# Altium project FPGA_SHIELD_MARK1.PrjPcb (part 2 of 2)

## Sheet LOGIC_MCU.SchDoc: Microcontroller Logical Interconnect
size B; Author: Michael Jones; Engineer: Michael Jones; Organization: Group VIII Technology; Address1: 1652 W 820 N; Address2: Provo; Address3: UT  84601; Address4: 801-379-0118; DocumentNumber: 6; Revision: A3; SheetNumber: 6; SheetTotal: 6
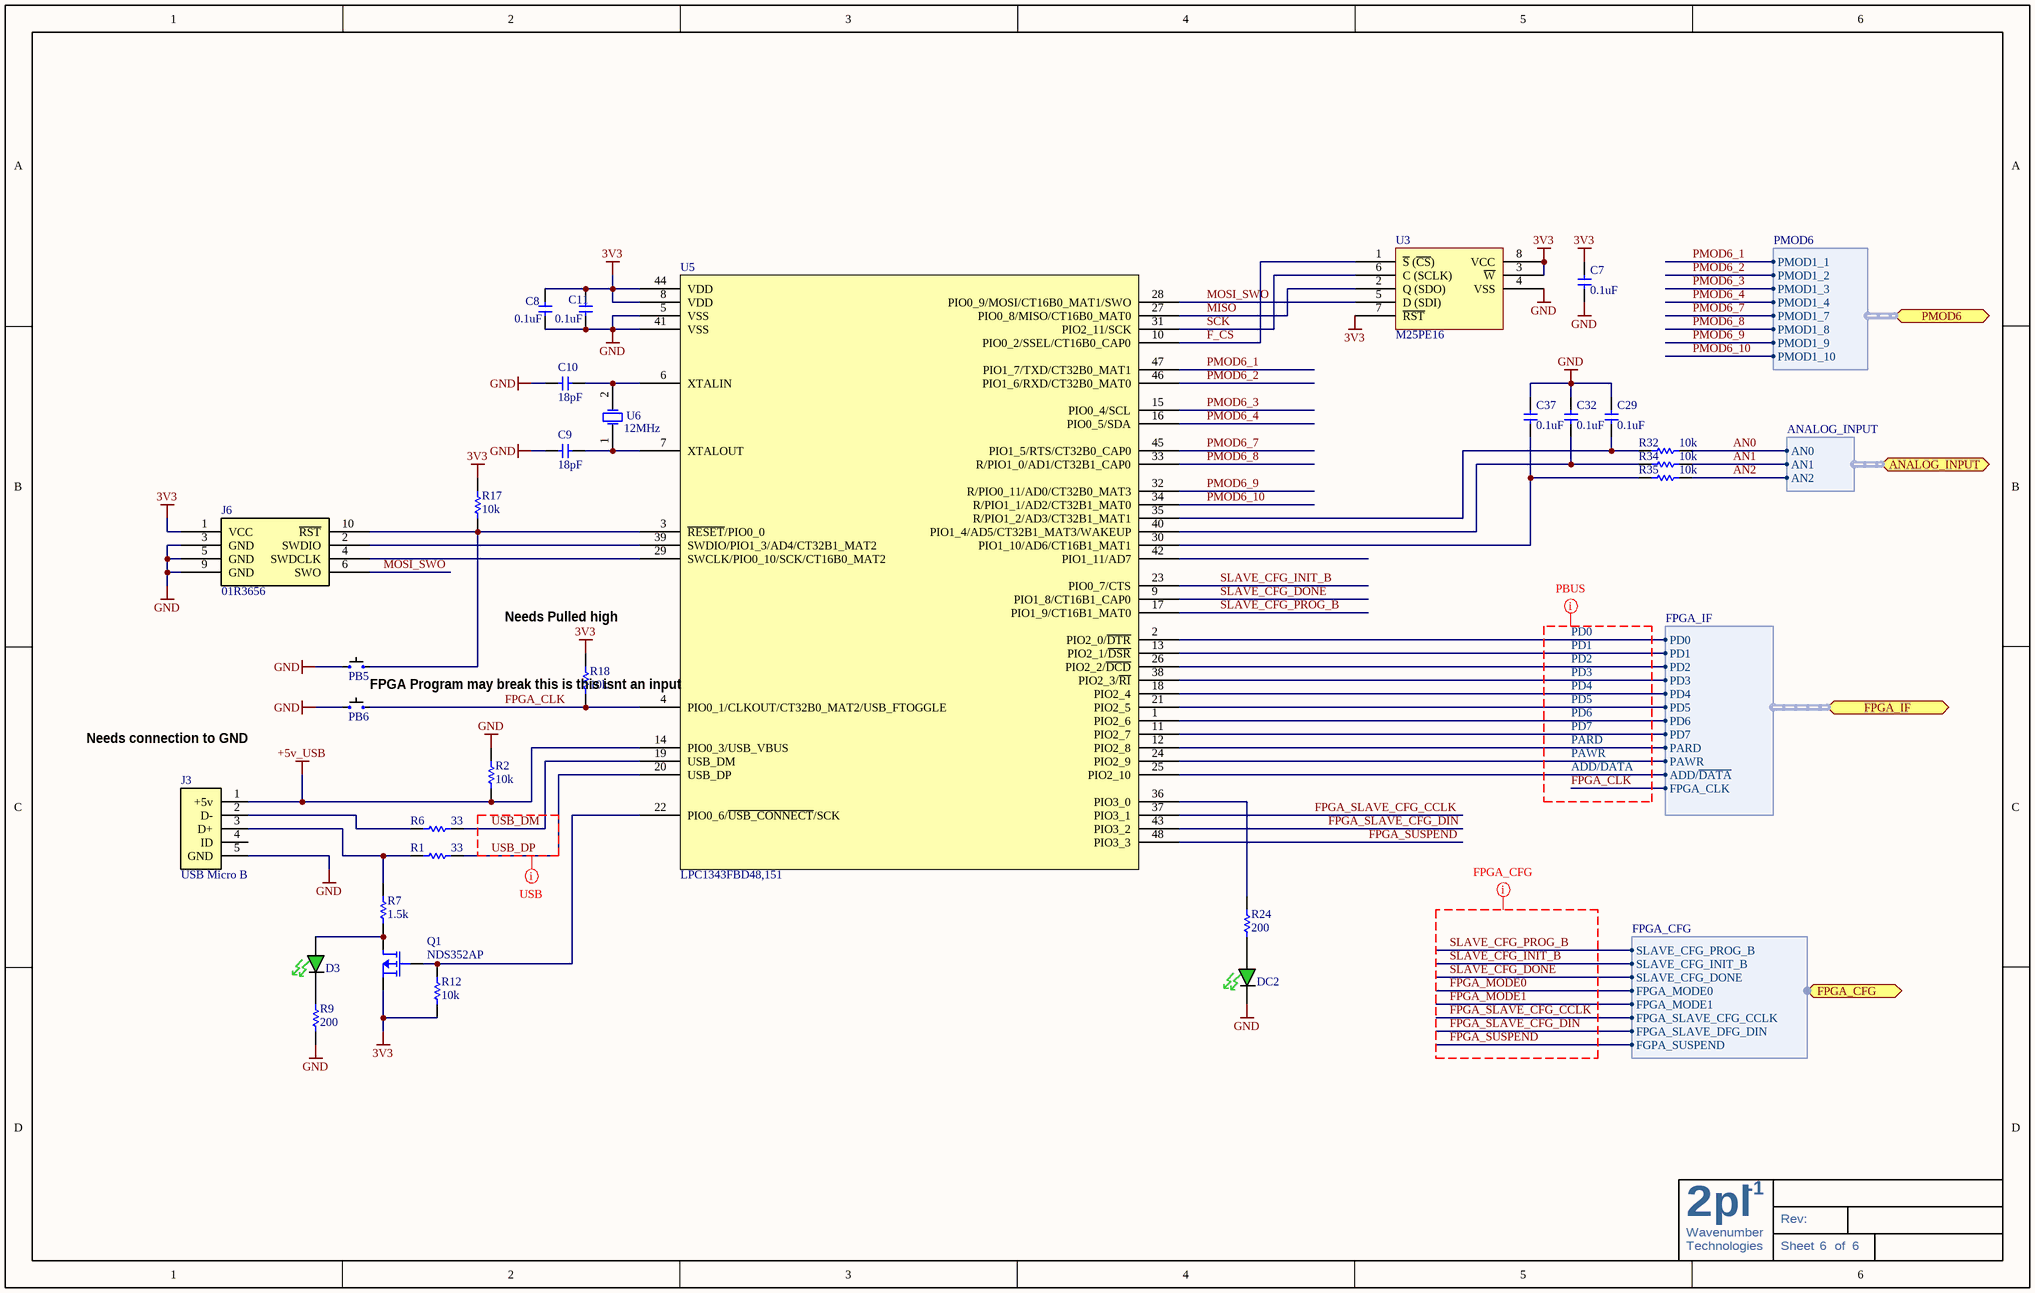
[diagram p4: LOGIC_MCU.SchDoc]

### Parts
(Parts that share a designator on the sheet are numbered #1, #2 ... from top to bottom, then left to right.)
C7#2  0.1uF  [C0603]
C8#2  0.1uF  [C0603]
C9#2  18pF  [C0603]
C10#2  18pF  [C0603]
C11#2  0.1uF  [C0603]
C29#2  0.1uF  [C0603]
C32#2  0.1uF  [C0603]
C37  0.1uF  [C0603]
D3#2  LED 1.6X0.8MM 570NM GRN CLR SMD  [LED_0603 - GREEN]  (value not drawn)
DC2  LED 1.6X0.8MM 570NM GRN CLR SMD  [LED_0603 - GREEN]  (value not drawn)
J3#2  USB Micro B  [10103594-0001LF - Testing Smaller Thru]
J6#2  01R3656  [FTSH-105-04-F-DV]
PB5  FSM4JSMA  [FSM4JSMA]  (value not drawn)
PB6  FSM4JSMA  [FSM4JSMA]  (value not drawn)
Q1  NDS352AP  [SOT-23]
R1#2  33  [R0603]
R2#2  10k  [R0603]
R6#2  33  [R0603]
R7#2  1.5k  [R0603]
R9  200  [R0603]
R12  10k  [R0603]
R17  10k  [R0603]
R18  10k  [R0603]
R24  200  [R0603]
R32  10k  [R0603]
R34  10k  [R0603]
R35  10k  [R0603]
U3#2  M25PE16  [SOIC127P830X200-8L]
U5  LPC1343FBD48,151  [TSQFP50P900X900X145-48L]
U6  12MHz  [ABM3]

### Ports
ANALOG_INPUT (harness ANALOG_INPUT), FPGA_CFG (harness FPGA_CFG), FPGA_IF (harness FPGA_IF), PMOD6 (harness PMOD6)

### Harnesses
FPGA_IF: PD0, PD1, PD2, PD3, PD4, PD5, PD6, PD7, PARD, PAWR, ADD/~{DATA}, FPGA_CLK
FPGA_CFG: SLAVE_CFG_PROG_B, SLAVE_CFG_INIT_B, SLAVE_CFG_DONE, FPGA_MODE0, FPGA_MODE1, FPGA_SLAVE_CFG_CCLK, FPGA_SLAVE_DFG_DIN, FGPA_SUSPEND
PMOD6: PMOD1_1, PMOD1_2, PMOD1_3, PMOD1_4, PMOD1_7, PMOD1_8, PMOD1_9, PMOD1_10
ANALOG_INPUT: AN0, AN1, AN2

### Nets
3V3: C7#2.2 C8#2.2 C11#2.2 J6#2.1(VCC) Q1.2(S) R12.2 R17.1 R18.1 U3#2.3(~{W}) U3#2.7(~{RST}) U3#2.8(VCC) U5.8(VDD) U5.44(VDD)
+5v_USB: J3#2.1(+5v) R2#2.2 U5.14(PIO0_3/USB_VBUS)
GND: C7#2.1 C8#2.1 C9#2.1 C10#2.1 C11#2.1 C29#2.2 C32#2.2 C37.2 DC2.C J3#2.5(GND) J6#2.3(GND) J6#2.5(GND) J6#2.9(GND) PB5.A PB6.A R2#2.1 R9.1 U3#2.4(VSS) U5.5(VSS) U5.41(VSS)
ADD/~{DATA}: U5.25(PIO2_10) ; port FPGA_IF.ADD/~{DATA}
AN0: R32.2 ; port ANALOG_INPUT.AN0
AN1: R34.2 ; port ANALOG_INPUT.AN1
AN2: R35.2 ; port ANALOG_INPUT.AN2
F_CS: U3#2.1(~{S}_(~{CS})) U5.10(PIO0_2/SSEL/CT16B0_CAP0)
FPGA_CLK: PB6.B R18.2 U5.4(PIO0_1/CLKOUT/CT32B0_MAT2/USB_FTOGGLE) ; port FPGA_IF.FPGA_CLK
FPGA_SLAVE_CFG_CCLK: U5.37(PIO3_1) ; port FPGA_CFG.FPGA_SLAVE_CFG_CCLK
FPGA_SLAVE_CFG_DIN: U5.43(PIO3_2) ; port FPGA_CFG.FPGA_SLAVE_DFG_DIN
FPGA_SUSPEND: U5.48(PIO3_3) ; port FPGA_CFG.FGPA_SUSPEND
MISO: U3#2.2(Q_(SDO)) U5.27(PIO0_8/MISO/CT16B0_MAT0)
MOSI_SWO: J6#2.6(SWO) U3#2.5(D_(SDI)) U5.28(PIO0_9/MOSI/CT16B0_MAT1/SWO)
PARD: U5.12(PIO2_8) ; port FPGA_IF.PARD
PAWR: U5.24(PIO2_9) ; port FPGA_IF.PAWR
PD0: U5.2(PIO2_0/~{DTR}) ; port FPGA_IF.PD0
PD1: U5.13(PIO2_1/~{DSR}) ; port FPGA_IF.PD1
PD2: U5.26(PIO2_2/~{DCD}) ; port FPGA_IF.PD2
PD3: U5.38(PIO2_3/~{RI}) ; port FPGA_IF.PD3
PD4: U5.18(PIO2_4) ; port FPGA_IF.PD4
PD5: U5.21(PIO2_5) ; port FPGA_IF.PD5
PD6: U5.1(PIO2_6) ; port FPGA_IF.PD6
PD7: U5.11(PIO2_7) ; port FPGA_IF.PD7
PMOD6_1: U5.47(PIO1_7/TXD/CT32B0_MAT1) ; port PMOD6.PMOD1_1
PMOD6_2: U5.46(PIO1_6/RXD/CT32B0_MAT0) ; port PMOD6.PMOD1_2
PMOD6_3: U5.15(PIO0_4/SCL) ; port PMOD6.PMOD1_3
PMOD6_4: U5.16(PIO0_5/SDA) ; port PMOD6.PMOD1_4
PMOD6_7: U5.45(PIO1_5/RTS/CT32B0_CAP0) ; port PMOD6.PMOD1_7
PMOD6_8: U5.33(R/PIO1_0/AD1/CT32B1_CAP0) ; port PMOD6.PMOD1_8
PMOD6_9: U5.32(R/PIO0_11/AD0/CT32B0_MAT3) ; port PMOD6.PMOD1_9
PMOD6_10: U5.34(R/PIO1_1/AD2/CT32B1_MAT0) ; port PMOD6.PMOD1_10
SCK: U3#2.6(C_(SCLK)) U5.31(PIO2_11/SCK)
SLAVE_CFG_DONE: U5.9(PIO1_8/CT16B1_CAP0) ; port FPGA_CFG.SLAVE_CFG_DONE
SLAVE_CFG_INIT_B: U5.23(PIO0_7/CTS) ; port FPGA_CFG.SLAVE_CFG_INIT_B
SLAVE_CFG_PROG_B: U5.17(PIO1_9/CT16B1_MAT0) ; port FPGA_CFG.SLAVE_CFG_PROG_B
USB_DM: R6#2.2 U5.19(USB_DM)
USB_DP: R1#2.2 U5.20(USB_DP)
NetC9#2_2: C9#2.2 U5.7(XTALOUT) U6.1(OSC1)
NetC10#2_2: C10#2.2 U5.6(XTALIN) U6.2(OSC2)
NetC29#2_1: C29#2.1 R32.1 U5.35(R/PIO1_2/AD3/CT32B1_MAT1)
NetC32#2_1: C32#2.1 R34.1 U5.40(PIO1_4/AD5/CT32B1_MAT3/WAKEUP)
NetC37_1: C37.1 R35.1 U5.30(PIO1_10/AD6/CT16B1_MAT1)
NetD3#2_A: D3#2.A Q1.3(D) R7#2.1
NetD3#2_C: D3#2.C R9.2
NetDC2_A: DC2.A R24.2
NetJ3#2_2: J3#2.2(D-) R6#2.1
NetJ3#2_3: J3#2.3(D+) R1#2.1 R7#2.2
NetJ6#2_2: J6#2.2(SWDIO) U5.39(SWDIO/PIO1_3/AD4/CT32B1_MAT2)
NetJ6#2_4: J6#2.4(SWDCLK) U5.29(SWCLK/PIO0_10/SCK/CT16B0_MAT2)
NetJ6#2_10: J6#2.10(~{RST}) PB5.B R17.2 U5.3(~{RESET}/PIO0_0)
NetQ1_1: Q1.1(G) R12.1 U5.22(PIO0_6/~{USB_CON}~{NECT}/SCK)
NetR24_1: R24.1 U5.36(PIO3_0)

Not connected (* = marked no-connect by the designer): J3#2 4(ID); U5 42(PIO1_11/AD7)

### Layout directives
net class PBUS: ADD/~{DATA}, FPGA_CLK, PARD, PAWR, PD0, PD1, PD2, PD3, PD4, PD5, PD6, PD7
net class FPGA_CFG: FPGA_MODE0, FPGA_MODE1, FPGA_SLAVE_CFG_CCLK, FPGA_SLAVE_CFG_DIN, FPGA_SUSPEND, SLAVE_CFG_DONE, SLAVE_CFG_INIT_B, SLAVE_CFG_PROG_B
net class USB: USB_DP

### Notes on the sheet
- Needs Pulled high
- FPGA Program may break this is this isnt an input
- Needs connection to GND
- 2
- Wavenumber
- pl
- -1
- Rev:
- Technologies
- Sheet
- of

### Library data of the parts
C7#2 C8#2 C11#2 C29#2 C32#2 C37 = GRM188R71H104KA93D: CAP CER .1UF 50V 10% X7R 0603; Manufacturer: Murata Electronics North America; Capacitance: 0.1µF; Value: 0.1uF; Supplier 1: Digi-Key; Supplier Part Number 1: 490-1519-1-ND; Manufacturer Part Number: GRM188R71H104KA93D; RoHS: RoHS Compliant; Category: Capacitors; Stock 1: 6315460; Pricing 1: 10=0.037, 100=0.0221, 500=0.01276, 1000=0.00884 (USD); Voltage - Rated: 50V; Tolerance: ±10%; Temperature Coefficient: X7R; Mounting Type: Surface Mount, MLCC; Operating Temperature: -55°C ~ 125°C; Features: -; Applications: General Purpose; Ratings: -; Package / Case: 0603 (1608 Metric); Size / Dimension: 0.063" L x 0.031" W (1.60mm x 0.80mm); Lead Spacing: -; Thickness: 0.80mm; Packaging: Cut Tape (CT); Lead Style: -; ComponentLink1URL: http://search.murata.co.jp/Ceramy/image/img/PDF/ENG/GRM188R71H104KA93.pdf; ComponentLink1Description: http://search.murata.co.jp/Ceramy/image/img/PDF/ENG/GRM188R71H104KA93.pdf
C9#2 C10#2 = GRM1885C1H180JA01D: CAP CER 18PF 50V 5% C0G 0603; Source Part Number: 490-1409-1-ND; Manufacturer: Murata Electronics North America; Temperature Coefficient: C0G, NP0; Source: Digikey; Manufacturer Part Number: GRM1885C1H180JA01D; ROHS Certificate: *; Value: CAP CER 18PF 50V 5% C0G 0603; Supplier 1: Digi-Key; Supplier Part Number 1: 490-1409-1-ND; RoHS: RoHS Compliant; Category: Capacitors; Stock 1: 357140; Pricing 1: 10=0.037, 100=0.0221, 500=0.01276, 1000=0.00884 (USD); Capacitance: 18pF; Voltage - Rated: 50V; Tolerance: ±5%; Mounting Type: Surface Mount, MLCC; Operating Temperature: -55°C ~ 125°C; Features: -; Applications: General Purpose; Ratings: -; Package / Case: 0603 (1608 Metric); Size / Dimension: 0.063" L x 0.031" W (1.60mm x 0.80mm); Lead Spacing: -; Thickness: 0.80mm; Packaging: Cut Tape (CT); Lead Style: -; ComponentLink1URL: http://search.murata.co.jp/Ceramy/image/img/PDF/ENG/GRM1885C1H180JA01.pdf; ComponentLink1Description: http://search.murata.co.jp/Ceramy/image/img/PDF/ENG/GRM1885C1H180JA01.pdf
D3#2 = APT1608CGCK: Manufacturer: Kingbright Corp; Color: Green; Current - Test: 20mA; Wavelength - Peak: 574nm; Millicandela Rating: 50mcd; Voltage - Forward (Vf) Typ: 2.1V; Lens Type: Clear; Lens Style/Size: Rectangle, 1.2mm x 0.8mm; Viewing Angle: 120°; Value: LED 1.6X0.8MM 570NM GRN CLR SMD; Supplier 1: Digi-Key; Supplier Part Number 1: 754-1116-2-ND; Manufacturer Part Number: APT1608CGCK; RoHS: RoHS Compliant; Description: LED 1.6X0.8MM 570NM GRN CLR SMD; Category: Optoelectronics; Stock 1: 94000; Pricing 1: 2000=0.051, 6000=0.045, 10000=0.043 (USD); Luminous Flux @ Current - Test: -; Wavelength - Dominant: 570nm; Size / Dimension: 1.60mm L x 0.80mm W; Height: 0.75mm; Package / Case: 0603 (1608 Metric); Mounting Type: Surface Mount; Packaging: Tape & Reel (TR); ComponentLink1URL: http://www.us.kingbright.com/images/catalog/SPEC/APT1608CGCK.pdf; ComponentLink1Description: http://www.us.kingbright.com/images/catalog/SPEC/APT1608CGCK.pdf
DC2 = APT1608CGCK: Manufacturer: Kingbright Corp; Current - Test: 20mA; Wavelength - Peak: 574nm; Millicandela Rating: 50mcd; Voltage - Forward (Vf) Typ: 2.1V; Lens Type: Clear; Lens Style/Size: Rectangle, 1.2mm x 0.8mm; Viewing Angle: 120°; Value: LED 1.6X0.8MM 570NM GRN CLR SMD; Supplier 1: Digi-Key; Supplier Part Number 1: 754-1116-2-ND; Manufacturer Part Number: APT1608CGCK; RoHS: RoHS Compliant; Description: LED 1.6X0.8MM 570NM GRN CLR SMD; Category: Optoelectronics; Stock 1: 94000; Pricing 1: 2000=0.051, 6000=0.045, 10000=0.043 (USD); Color: Green; Luminous Flux @ Current - Test: -; Wavelength - Dominant: 570nm; Size / Dimension: 1.60mm L x 0.80mm W; Height: 0.75mm; Package / Case: 0603 (1608 Metric); Mounting Type: Surface Mount; Packaging: Tape & Reel (TR); ComponentLink1URL: http://www.us.kingbright.com/images/catalog/SPEC/APT1608CGCK.pdf; ComponentLink1Description: http://www.us.kingbright.com/images/catalog/SPEC/APT1608CGCK.pdf
J3#2 = 10103594-0001LF - USB Micro: CONN RCPT STD MICRO USB TYPE B; Manufacturer: FCI; Connector Type: USB - micro B; Number of Contacts: 5; Gender: Receptacle; Specifications: USB 2.0; Micro USB B: Value; Notes: Similar to; Supplier 1: Digi-Key; Manufacturer Part Number: 10103594-0001LF; RoHS: RoHS Compliant; Category: Connectors, Interconnects; Stock 1: 23288; Pricing 1: 1=1.1, 10=0.768, 100=0.517, 250=0.43912, 500=0.41716 (USD); Mounting Type: Surface Mount, Right Angle, Horizontal; Features: Shielded, Solder Retention; Packaging: Cut Tape (CT); Ingress Protection: -; ComponentLink1URL: http://portal.fciconnect.com/res/en/pdffiles/doc_search/10103594.pdf; ComponentLink1Description: http://portal.fciconnect.com/res/en/pdffiles/doc_search/10103594.pdf; Supplier Part Number 1: 609-4050-1-ND; Value: USB Micro B
J6#2 = Cortex SWD  Connector: Cortex SWD Connector; Manufacturer: SAMTEC; Description: SAMTEC - FTSH-105-04-F-DV - .050 X .050; Supplier 1: Newark; Supplier Part Number 1: 01R3656; Manufacturer Part Number: FTSH-105-04-F-DV; Category: Connectors; Stock 1: 0; Pricing 1: 1=0.871, 25000=0.754, 50000=0.705 (USD); Value: 01R3656
PB5 PB6 = FSM4JSMATR: SWITCH TACTILE SPST-NO 0.05A 12V; Manufacturer: TE Connectivity; Switch Function: Off-Mom; Contact Rating @ Voltage: 0.05A @ 12VDC; Actuator Type: Standard; Outline: 6.00mm x 6.00mm; Illumination: Non-Illuminated; Operating Force: 160gf; Supplier 1: Digi-Key; Supplier Part Number 1: 450-1759-2-ND; Manufacturer Part Number: FSM4JSMATR; RoHS: RoHS Compliant; Category: Switches; Stock 1: 40800; Pricing 1: 1200=0.154, 2400=0.141, 6000=0.132, 8400=0.123, 12000=0.119, 30000=0.117, 60000=0.115 (USD); Circuit: SPST-NO; Mounting Type: Surface Mount; Termination Style: Gull Wing; Orientation: Vertical; Packaging: Tape & Reel (TR); ComponentLink1URL: http://documents.tycoelectronics.com/commerce/DocumentDelivery/DDEController?Action=srchrtrv&DocNm=2-1437565-7&DocType=CD&DocLang=EN; ComponentLink1Description: http://documents.tycoelectronics.com/commerce/DocumentDelivery/DDEController?Action=srchrtrv&DocNm=2-1437565-7&DocType=CD&DocLang=EN; Value: FSM4JSMA
Q1 = NDS352AP: MOSFET P-CH 30V 900MA SSOT3; Manufacturer: Fairchild Semiconductor; FET Type: MOSFET P-Channel, Metal Oxide; FET Feature: Logic Level Gate; Rds On (Max) @ Id, Vgs: 300 mOhm @ 1A, 10V; Vgs(th) (Max) @ Id: 2.5V @ 250µA; Gate Charge (Qg) @ Vgs: 3nC @ 4.5V; Input Capacitance (Ciss) @ Vds: 135pF @ 15V; Power - Max: 460mW; Value: NDS352AP; Supplier 1: Digi-Key; Supplier Part Number 1: NDS352APCT-ND; Manufacturer Part Number: NDS352AP; RoHS: RoHS Compliant; Category: Discrete Semiconductor Products; Stock 1: 165125; Pricing 1: 1=0.61, 10=0.485, 100=0.364, 250=0.31436, 500=0.27024, 750=0.23163, 1000=0.20957, 2000=0.19303 (USD); Drain to Source Voltage (Vdss): 30V; Current - Continuous Drain (Id) @ 25° C: 900mA; Mounting Type: Surface Mount; Package / Case: TO-236-3, SC-59, SOT-23-3; Packaging: Cut Tape (CT); Supplier Device Package: 3-SSOT; ComponentLink1URL: http://media.digikey.com/pdf/Data%20Sheets/Fairchild%20PDFs/NDS352AP.pdf; ComponentLink1Description: http://media.digikey.com/pdf/Data%20Sheets/Fairchild%20PDFs/NDS352AP.pdf
R1#2 R6#2 = ERJ-3EKF33R0V: RES 33.0 OHM 1/10W 1% 0603 SMD; Manufacturer: Panasonic - ECG; Resistance (Ohms): 33.0; Power (Watts): 0.1W, 1/10W; Temperature Coefficient: ±100ppm/°C; Value: 33; Supplier 1: Digi-Key; Supplier Part Number 1: P33.0HCT-ND; Manufacturer Part Number: ERJ-3EKF33R0V; RoHS: RoHS Compliant; Category: Resistors; Stock 1: 247775; Pricing 1: 1=0.04, 50=0.015, 100=0.0114, 250=0.00844, 500=0.00624, 1000=0.00416 (USD); Composition: Thick Film; Features: -; Tolerance: ±1%; Size / Dimension: 0.063" L x 0.031" W (1.60mm x 0.80mm); Height: 0.018" (0.45mm); Lead Style: Surface Mount (SMD - SMT); Packaging: Cut Tape (CT); Package / Case: 0603 (1608 Metric); ComponentLink1URL: http://industrial.panasonic.com/www-cgi/jvcr13pz.cgi?E+PZ+3+AOA0002+ERJ3EKF33R0V+7+WW; ComponentLink1Description: http://industrial.panasonic.com/www-cgi/jvcr13pz.cgi?E+PZ+3+AOA0002+ERJ3EKF33R0V+7+WW
R2#2 R12 R17 R18 R32 R34 R35 = ERJ-3EKF1002V: RES 10.0K OHM 1/10W 1% 0603 SMD; Source Part Number: P10.0KHCT-ND; Manufacturer: Panasonic - ECG; Power (Watts): 0.1W, 1/10W; Temperature Coefficient: ±100ppm/°C; Source: Digikey; ROHS Certificate: *; RoHS: RoHS Compliant; Category: Resistors; Resistance In Ohms: 10.0K; Composition: Thick Film; Features: -; Tolerance: ±1%; Case: 0603 (1608 metric); Size / Dimension: 0.063" L x 0.031" W (1.60mm x 0.80mm); Height: 0.018" (0.45mm); Lead Style: Surface Mount (SMD - SMT); Packaging: Cut Tape (CT); ComponentLink1URL: http://industrial.panasonic.com/www-cgi/jvcr13pz.cgi?E+PZ+3+AOA0002+ERJ3EKF1002V+7+WW; ComponentLink1Description: http://industrial.panasonic.com/www-cgi/jvcr13pz.cgi?E+PZ+3+AOA0002+ERJ3EKF1002V+7+WW; Manufacturer Part Number: ERJ-3EKF1002V; Supplier 1: Digi-Key; Stock 1: 10570746; Pricing 1: 1=0.04, 50=0.015, 100=0.0114, 250=0.00844, 500=0.00624, 1000=0.00416 (USD); Supplier Part Number 1: P10.0KHCT-ND; Value: 10k
R7#2 = ERJ-3EKF1501V: RES 1.50K OHM 1/10W 1% 0603 SMD; Manufacturer: Panasonic - ECG; Power (Watts): 0.1W, 1/10W; Temperature Coefficient: ±100ppm/°C; Value: 1.5k; Supplier 1: Digi-Key; Supplier Part Number 1: P1.50KHCT-ND; Manufacturer Part Number: ERJ-3EKF1501V; RoHS: RoHS Compliant; Category: Resistors; Stock 1: 1714688; Pricing 1: 1=0.04, 50=0.015, 100=0.0114, 250=0.00844, 500=0.00624, 1000=0.00416 (USD); Resistance (Ohms): 1.50K; Composition: Thick Film; Features: -; Tolerance: ±1%; Size / Dimension: 0.063" L x 0.031" W (1.60mm x 0.80mm); Height: 0.018" (0.45mm); Lead Style: Surface Mount (SMD - SMT); Packaging: Cut Tape (CT); Package / Case: 0603 (1608 Metric); ComponentLink1URL: http://industrial.panasonic.com/www-cgi/jvcr13pz.cgi?E+PZ+3+AOA0002+ERJ3EKF1501V+7+WW; ComponentLink1Description: http://industrial.panasonic.com/www-cgi/jvcr13pz.cgi?E+PZ+3+AOA0002+ERJ3EKF1501V+7+WW
R9 R24 = ERJ-3EKF2000V: RES 200 OHM 1/10W 1% 0603 SMD; Manufacturer: Panasonic - ECG; Power (Watts): 0.1W, 1/10W; Temperature Coefficient: ±100ppm/°C; Manufacturer Part Number: ERJ-3EKF2000V; Value: RES 200 OHM 1/10W 1% 0603 SMD; Supplier 1: Digi-Key; Supplier Part Number 1: P200HCT-ND; RoHS: RoHS Compliant; Category: Resistors; Stock 1: 1279595; Pricing 1: 1=0.04, 50=0.015, 100=0.0114, 250=0.00844, 500=0.00624, 1000=0.00416 (USD); Resistance (Ohms): 200; Composition: Thick Film; Features: -; Tolerance: ±1%; Size / Dimension: 0.063" L x 0.031" W (1.60mm x 0.80mm); Height: 0.018" (0.45mm); Lead Style: Surface Mount (SMD - SMT); Packaging: Cut Tape (CT); Package / Case: 0603 (1608 Metric); ComponentLink1URL: http://industrial.panasonic.com/www-cgi/jvcr13pz.cgi?E+PZ+3+AOA0002+ERJ3EKF2000V+7+WW; ComponentLink1Description: http://industrial.panasonic.com/www-cgi/jvcr13pz.cgi?E+PZ+3+AOA0002+ERJ3EKF2000V+7+WW
U3#2 = M25PE16-VMW6TG: IC FLASH 16MBIT 75MHZ 8SOIC; Manufacturer: Numonyx/ST Micro; Memory Size: 16M (2M x 8); Interface: SPI, 3-Wire Serial; Voltage - Supply: 2.7 V ~ 3.6 V; Supplier 1: Digi-Key; Manufacturer Part Number: M25PE16-VMW6TG; RoHS: RoHS Compliant; Category: Integrated Circuits (ICs); Stock 1: 866; Pricing 1: 1=2.31, 10=1.98, 25=1.782, 100=1.617, 250=1.452, 500=1.254 (USD); Format - Memory: FLASH; Memory Type: FLASH; Speed: 75MHz; Operating Temperature: -40°C ~ 85°C; Package / Case: 8-SOIC (0.200", 5.30mm Width); Packaging: Cut Tape (CT); Supplier Device Package: *; ComponentLink1URL: http://www.numonyx.com/Documents/Datasheets/M25PE16.pdf; ComponentLink1Description: http://www.numonyx.com/Documents/Datasheets/M25PE16.pdf; Supplier Part Number 1: M25PE16-VMW6TGCT-ND; Value: M25PE16
U5 = LPC1343FBD48,151: IC MCU 32BIT 32KB FLASH 48LQFP; Manufacturer: NXP Semiconductors; Core Processor: ARM® Cortex-M3™; Core Size: 32-Bit; Speed: 72MHz; Connectivity: I²C, Microwire, SPI, SSI, SSP, UART/USART, USB; Peripherals: Brown-out Detect/Reset, POR, WDT; Number of I /O: 40; Program Memory Size: 32KB (32K x 8); RAM Size: 8K x 8; Voltage - Supply (Vcc/Vdd): 2 V ~ 3.6 V; Data Converters: A/D 8x10b; Oscillator Type: Internal; Value: LPC1343FBD48,151; Supplier 1: Digi-Key; Supplier Part Number 1: 568-4945-ND; Manufacturer Part Number: LPC1343FBD48,151; RoHS: RoHS Compliant; Category: Integrated Circuits (ICs); Stock 1: 734; Pricing 1: 1=6.3, 25=5.0624, 100=4.6125, 250=4.16252, 500=3.735, 1000=3.15, 2500=2.9925, 5000=2.86875 (USD); Program Memory Type: FLASH; EEPROM Size: -; Operating Temperature: -40°C ~ 85°C; Package / Case: 48-LQFP; Packaging: Tray; ComponentLink1URL: http://ics.nxp.com/products/lpc1000/datasheet/lpc1311.lpc1313.lpc1342.lpc1343.pdf; ComponentLink1Description: http://ics.nxp.com/products/lpc1000/datasheet/lpc1311.lpc1313.lpc1342.lpc1343.pdf
U6 = ABM3-12.000MHZ-B2-T: CRYSTAL 12.000MHZ 18PF SMD; Manufacturer: Abracon Corporation; Frequency Stability: ±50ppm; Frequency Tolerance: ±20ppm; Operating Mode: Fundamental; Supplier 1: Digi-Key; Manufacturer Part Number: ABM3-12.000MHZ-B2-T; RoHS: RoHS Compliant; Category: Crystals and Oscillators; Stock 1: 22557; Pricing 1: 1=1.88, 10=1.625, 50=1.425, 100=1.125, 500=0.95 (USD); Type: MHz Crystal; Frequency: 12MHz; Load Capacitance: 18pF; Operating Temperature: -20°C ~ 70°C; Mounting Type: Surface Mount; Package / Case: 2-SMD, No Lead (DFN, LCC); Size / Dimension: 0.197" L x 0.126" W (5.00mm x 3.20mm); Height: 0.051" (1.30mm); Packaging: Cut Tape (CT); ComponentLink1URL: http://www.abracon.com/Resonators/abm3.pdf; ComponentLink1Description: http://www.abracon.com/Resonators/abm3.pdf; Supplier Part Number 1: 535-9100-1-ND; Value: 12MHz

## Nets that join several sheets
1V2: POWER_SUPPLY (C36.2 U8#1.3), FPGA_POWER_AND_CONFIGURATION (10 pins)
3V3: POWER_SUPPLY (6 pins), LOGIC_FPGA (C33.2 U10.1 U10.4), FPGA_POWER_AND_CONFIGURATION (51 pins), DIGITAL_IO (12 pins), LOGIC_MCU (13 pins)
+5v_USB: POWER_SUPPLY (D3#1.2), LOGIC_MCU (J3#2.1 R2#2.2 U5.14)
+5v_USB_FTDI: POWER_SUPPLY (D5.2), DIGITAL_IO (C2#2.2 J1.1 U1#2.10)
GND: POWER_SUPPLY (10 pins), LOGIC_FPGA (5 pins), FPGA_POWER_AND_CONFIGURATION (54 pins), DIGITAL_IO (34 pins), LOGIC_MCU (20 pins)
ADD/~{DATA}: LOGIC_FPGA (U8#2.131), LOGIC_MCU (U5.25)
DIP_SW0: LOGIC_FPGA (U8#2.5), DIGITAL_IO (R3#2.2 SW1.A1)
DIP_SW1: LOGIC_FPGA (U8#2.6), DIGITAL_IO (R8#2.2 SW1.A2)
DIP_SW2: LOGIC_FPGA (U8#2.7), DIGITAL_IO (R10.2 SW1.A3)
DIP_SW3: LOGIC_FPGA (U8#2.8), DIGITAL_IO (R11.2 SW1.A4)
DIP_SW4: LOGIC_FPGA (U8#2.9), DIGITAL_IO (R13#2.2 SW1.A5)
DIP_SW5: LOGIC_FPGA (U8#2.10), DIGITAL_IO (R14.2 SW1.A6)
DIP_SW6: LOGIC_FPGA (U8#2.11), DIGITAL_IO (R15.2 SW1.A7)
DIP_SW7: LOGIC_FPGA (U8#2.12), DIGITAL_IO (R16.2 SW1.A8)
FPGA_SLAVE_CFG_CCLK: FPGA_POWER_AND_CONFIGURATION (R2#1.1 R7#1.2 U1#1.70 U2.6), LOGIC_MCU (U5.37)
FPGA_SLAVE_CFG_DIN: FPGA_POWER_AND_CONFIGURATION (U1#1.65 U2.2), LOGIC_MCU (U5.43)
FPGA_SUSPEND: FPGA_POWER_AND_CONFIGURATION (U1#1.73), LOGIC_MCU (U5.48)
FTDI_RX: LOGIC_FPGA (U8#2.41), DIGITAL_IO (U1#2.2)
FTDI_TX: LOGIC_FPGA (U8#2.43), DIGITAL_IO (U1#2.15)
LED0: LOGIC_FPGA (U8#2.56), DIGITAL_IO (R19.2)
LED1: LOGIC_FPGA (U8#2.51), DIGITAL_IO (R20.2)
LED2: LOGIC_FPGA (U8#2.50), DIGITAL_IO (R21.2)
LED3: LOGIC_FPGA (U8#2.48), DIGITAL_IO (R22.2)
LED4: LOGIC_FPGA (U8#2.47), DIGITAL_IO (R23.2)
LED5: LOGIC_FPGA (U8#2.46), DIGITAL_IO (R25.2)
LED6: LOGIC_FPGA (U8#2.45), DIGITAL_IO (R26.2)
LED7: LOGIC_FPGA (U8#2.44), DIGITAL_IO (R27.2)
PARD: LOGIC_FPGA (U8#2.133), LOGIC_MCU (U5.12)
PAWR: LOGIC_FPGA (U8#2.132), LOGIC_MCU (U5.24)
PB0: LOGIC_FPGA (U8#2.57), DIGITAL_IO (PB0.B R28.1)
PB1: LOGIC_FPGA (U8#2.58), DIGITAL_IO (PB1.B R29.1)
PB2: LOGIC_FPGA (U8#2.59), DIGITAL_IO (PB2.B R31.1)
PB3: LOGIC_FPGA (U8#2.61), DIGITAL_IO (PB3.B R38.1)
PD0: LOGIC_FPGA (U8#2.143), LOGIC_MCU (U5.2)
PD1: LOGIC_FPGA (U8#2.142), LOGIC_MCU (U5.13)
PD2: LOGIC_FPGA (U8#2.141), LOGIC_MCU (U5.26)
PD3: LOGIC_FPGA (U8#2.140), LOGIC_MCU (U5.38)
PD4: LOGIC_FPGA (U8#2.139), LOGIC_MCU (U5.18)
PD5: LOGIC_FPGA (U8#2.138), LOGIC_MCU (U5.21)
PD6: LOGIC_FPGA (U8#2.137), LOGIC_MCU (U5.1)
PD7: LOGIC_FPGA (U8#2.134), LOGIC_MCU (U5.11)
SLAVE_CFG_DONE: FPGA_POWER_AND_CONFIGURATION (D1.A U1#1.71), LOGIC_MCU (U5.9)
SLAVE_CFG_INIT_B: FPGA_POWER_AND_CONFIGURATION (R4#1.1 U1#1.39), LOGIC_MCU (U5.23)
SLAVE_CFG_PROG_B: FPGA_POWER_AND_CONFIGURATION (R3#1.1 U1#1.37), LOGIC_MCU (U5.17)